# Altium schematic sheet Pinout.SchDoc
size A; SheetNumber: 1; SheetTotal: 5
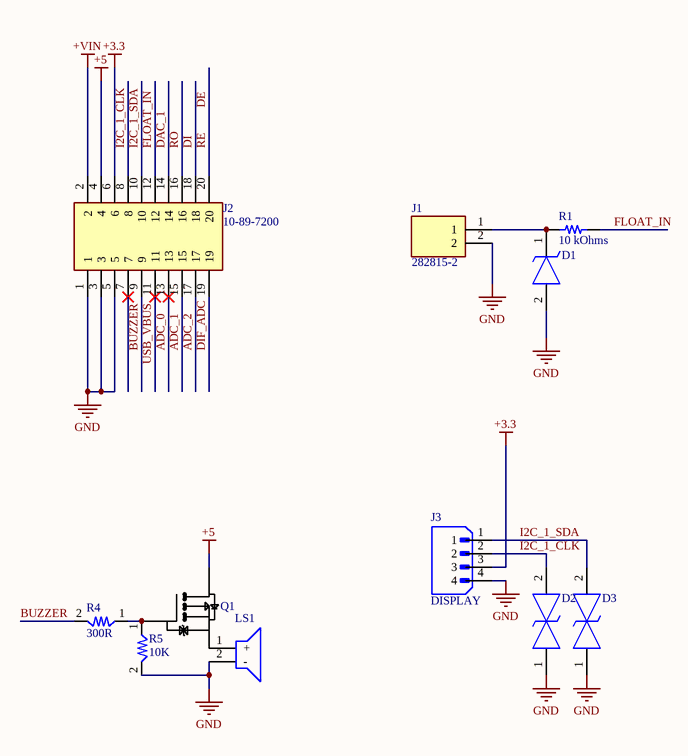
[diagram p0: Pinout.SchDoc]

## Parts
D1  SMBJ5.0A  [SMBJ12A]  (value not drawn)
D2  DESD3V3Z1BCSF-7  [DESD3V3Z1BCSF7]  (value not drawn)
D3  DESD3V3Z1BCSF-7  [DESD3V3Z1BCSF7]  (value not drawn)
J1  282815-2  [SHDRRA2W102P0X508_1X2_1016X1200X850P]
J2  10-89-7200  [HDRV20W87P254_2X10_2553X508X864P]
J3  DISPLAY  [JST_B4B-XH-A(LF)(SN)]
LS1  CMI-1295IC-0585T  [CMI1295IC0585T]  (value not drawn)
Q1  DMG3415U-7  [SOT96P240X110-3N]  (value not drawn)
R1  10 kOhms  [RES 0603_1608]
R4  300R  [RES0603]
R5  10K  [RES0603]

## Nets
+3.3: J2.6 J3.3
+5: J2.4 Q1.3(D)
+VIN: J2.2
GND: D1.2(A) D2.1 D3.1 J1.2 J2.1 J2.3 J2.5 J3.4 LS1.2(-) R5.2
ADC_0: J2.13
ADC_1: J2.15
ADC_2: J2.17
BUZZER: J2.9 R4.2
DAC_1: J2.14
DE: J2.20  [also labelled RE]
DI: J2.18
DIF_ADC: J2.19
FLOAT_IN: J2.12 R1.1
I2C_1_CLK: D2.2 J2.8 J3.2
I2C_1_SDA: D3.2 J2.10 J3.1
RO: J2.16
USB_VBUS: J2.11
NetD1_1: D1.1(K) J1.1 R1.2
NetLS1_1: LS1.1(+) Q1.2(S)
NetQ1_1: Q1.1(G) R4.1 R5.1

Not connected (* = marked no-connect by the designer): J2 7*

## Library data of the parts
D1 = SMBJ5.0A: TVS Diode (Uni-directional); Manufacturer_Name: STMicroelectronics; Datasheet Link: https://www.st.com/resource/en/datasheet/smbj12a.pdf; Height: 2.45mm; Manufacturer_Part_Number: SMBJ5.0A
D2 D3 = DESD3V3Z1BCSF-7: TVS Diode (Bi-directional); Manufacturer_Name: Diodes Incorporated; Datasheet Link: https://www.diodes.com/assets/Package-Files/X2-WLB0603-2.pdf; Height: 0.32mm; Manufacturer_Part_Number: DESD3V3Z1BCSF-7; Mouser Part Number: 621-DESD3V3Z1BCSF-7; Mouser Price/Stock: https://www.mouser.co.uk/ProductDetail/Diodes-Incorporated/DESD3V3Z1BCSF-7?qs=HXFqYaX1Q2xS5VnKZuyjmg%3D%3D; Arrow Part Number: DESD3V3Z1BCSF-7; Arrow Price/Stock: https://www.arrow.com/en/products/desd3v3z1bcsf-7/diodes-incorporated?utm_currency=USD&region=nac
J1 = 282815-2: Connector; Manufacturer_Name: TE Connectivity; Datasheet Link: https://www.te.com/commerce/DocumentDelivery/DDEController?Action=srchrtrv&DocNm=1-773958-1&DocType=Data%20Sheet&DocLang=English&PartCntxt=282815-2&DocFormat=pdf; Height: 8.5mm; Manufacturer_Part_Number: 282815-2; Mouser Part Number: 571-282815-2; Mouser Price/Stock: https://www.mouser.co.uk/ProductDetail/TE-Connectivity/282815-2?qs=79%2FjLZ2kXkpF7MFURi982A%3D%3D; Arrow Part Number: 282815-2; Arrow Price/Stock: https://www.arrow.com/en/products/282815-2/te-connectivity?region=nac
J2 = 10-89-7200: Connector; Manufacturer_Name: Molex; Datasheet Link: https://www.molex.com/content/dam/molex/molex-dot-com/products/automated/en-us/salesdrawingpdf/702/70280/010897200_sd.pdf?inline; Height: 8.64mm; Manufacturer_Part_Number: 10-89-7200; Mouser Part Number: 538-10-89-7200; Mouser Price/Stock: https://www.mouser.co.uk/ProductDetail/Molex/10-89-7200?qs=oWQp3ZoCHH25CPUgqQXm8A%3D%3D
J3 = B4B-XH-A(LF)(SN): Connector Header Through Hole 4 position 0.098 (2.50mm); MF: JST Sales; SnapEDA_Link: https://www.snapeda.com/parts/B4B-XH-A(LF)(SN)/JST+Sales+America+Inc./view-part/?ref=snap; Package: None; Value: *; MP: B4B-XH-A(LF)(SN); Check_prices: https://www.snapeda.com/parts/B4B-XH-A(LF)(SN)/JST+Sales+America+Inc./view-part/?ref=eda
LS1 = CMI-1295IC-0585T: Loudspeaker or Buzzer; Manufacturer_Name: Same Sky; Datasheet Link: https://www.sameskydevices.com/product/resource/CMI-1295IC-0585T.pdf; Height: 9.7mm; Manufacturer_Part_Number: CMI-1295IC-0585T; Mouser Part Number: 490-CMI-1295IC-0585T; Mouser Price/Stock: https://www.mouser.co.uk/ProductDetail/Same-Sky/CMI-1295IC-0585T?qs=OlC7AqGiEDkuskN%2Fok3iNw%3D%3D; Arrow Part Number: CMI-1295IC-0585T; Arrow Price/Stock: https://www.arrow.com/en/products/cmi-1295ic-0585t/cui-devices?utm_currency=USD&region=nac
Q1 = DMG3415U-7: Integrated Circuit; Manufacturer_Name: Lattice Semiconductor; Datasheet Link: https://media.digikey.com/pdf/Data%20Sheets/Diodes%20PDFs/DMG3415U.pdf; Height: 1.1mm; Manufacturer_Part_Number: DMG3415U-7; Mouser Part Number: N/A; Mouser Price/Stock: https://www.mouser.com/Search/Refine.aspx?Keyword=N%2FA
R1 = RT0603FRE0710KL: RES SMD 10K OHM 1% 1/10W 0603; Manufacturer: Yageo; Power (Watts): 0.1W, 1/10W; Temperature Coefficient: ±50ppm/°C; Part Number: RT0603FRE0710KL; Value: 10 kOhms; ComponentLink1Description: Datasheet; ComponentLink1URL: https://www.yageo.com/upload/media/product/productsearch/datasheet/rchip/PYu-RT_1-to-0.01_RoHS_L_11.pdf; ComponentLink2Description: DigiKey Link; ComponentLink2URL: https://www.digikey.com/en/products/detail/yageo/RT0603FRE0710KL/1075040; Composition: Thin Film; Device Package: 0603 (1608 Metric); Height - Seated (Max): 0.022" (0.55mm); LastUpdated: 9/19/2022 1:22:31 PM; Lifecycle Status: Active; Minimum Order: 1; Number of Terminations: 2; Operating Temperature: -55°C ~ 155°C; Package / Case: 0603 (1608 Metric); Packaging: TapeAndReel; PartId: 5671; Part Status: Active; Price: 0.01; Resistance: 10 kOhms; Series: RT; Size / Dimension: 0.063" L x 0.031" W (1.60mm x 0.80mm); Supplier 1: DigiKey; Supplier Part Number 1: YAG2321CT-ND; Supplier Device Package: 0603; Tolerance: ±1%
R4 R5 = RES: Resistor; Manufacturer_Name: UNI-ROYAL(Uniroyal Elec); Manufacturer_Part_Number: 0603WAF1001T5E; Datasheet Link: https://datasheet.lcsc.com/szlcsc/Uniroyal-Elec-0603WAF1001T5E_C21190.pdf; Height: 0.55mm